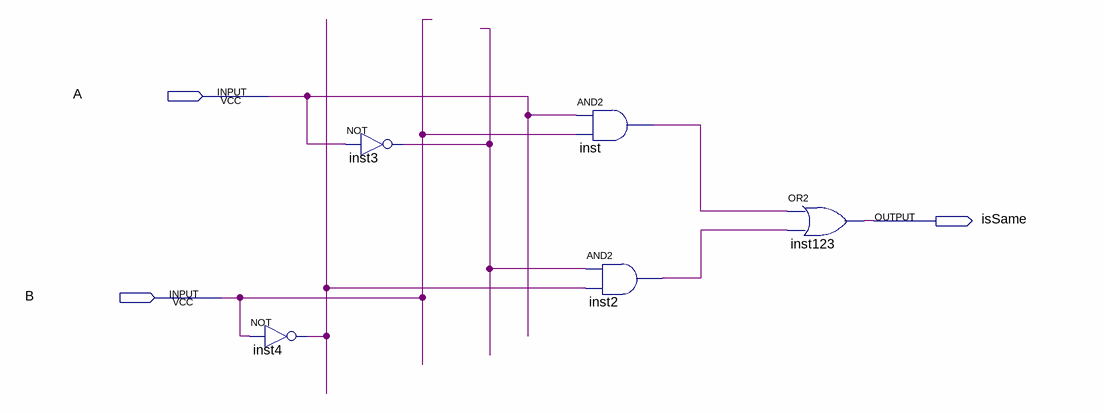
[diagram p0: schematic sheet]
// Quartus schematic isSame_1bit.bdf as structural Verilog: 5 symbols, 3 pins
module isSame_1bit (
  input  A,
  input  B,
  output isSame
);

  wire inst2_out, inst3_out, inst4_out, inst_out;

  not inst4 (inst4_out, B);
  not inst3 (inst3_out, A);
  and inst (inst_out, A, B);
  and inst2 (inst2_out, inst3_out, inst4_out);
  or inst123 (isSame, inst_out, inst2_out);
endmodule
